# EAGLE design cachev (EAGLE 5.04)
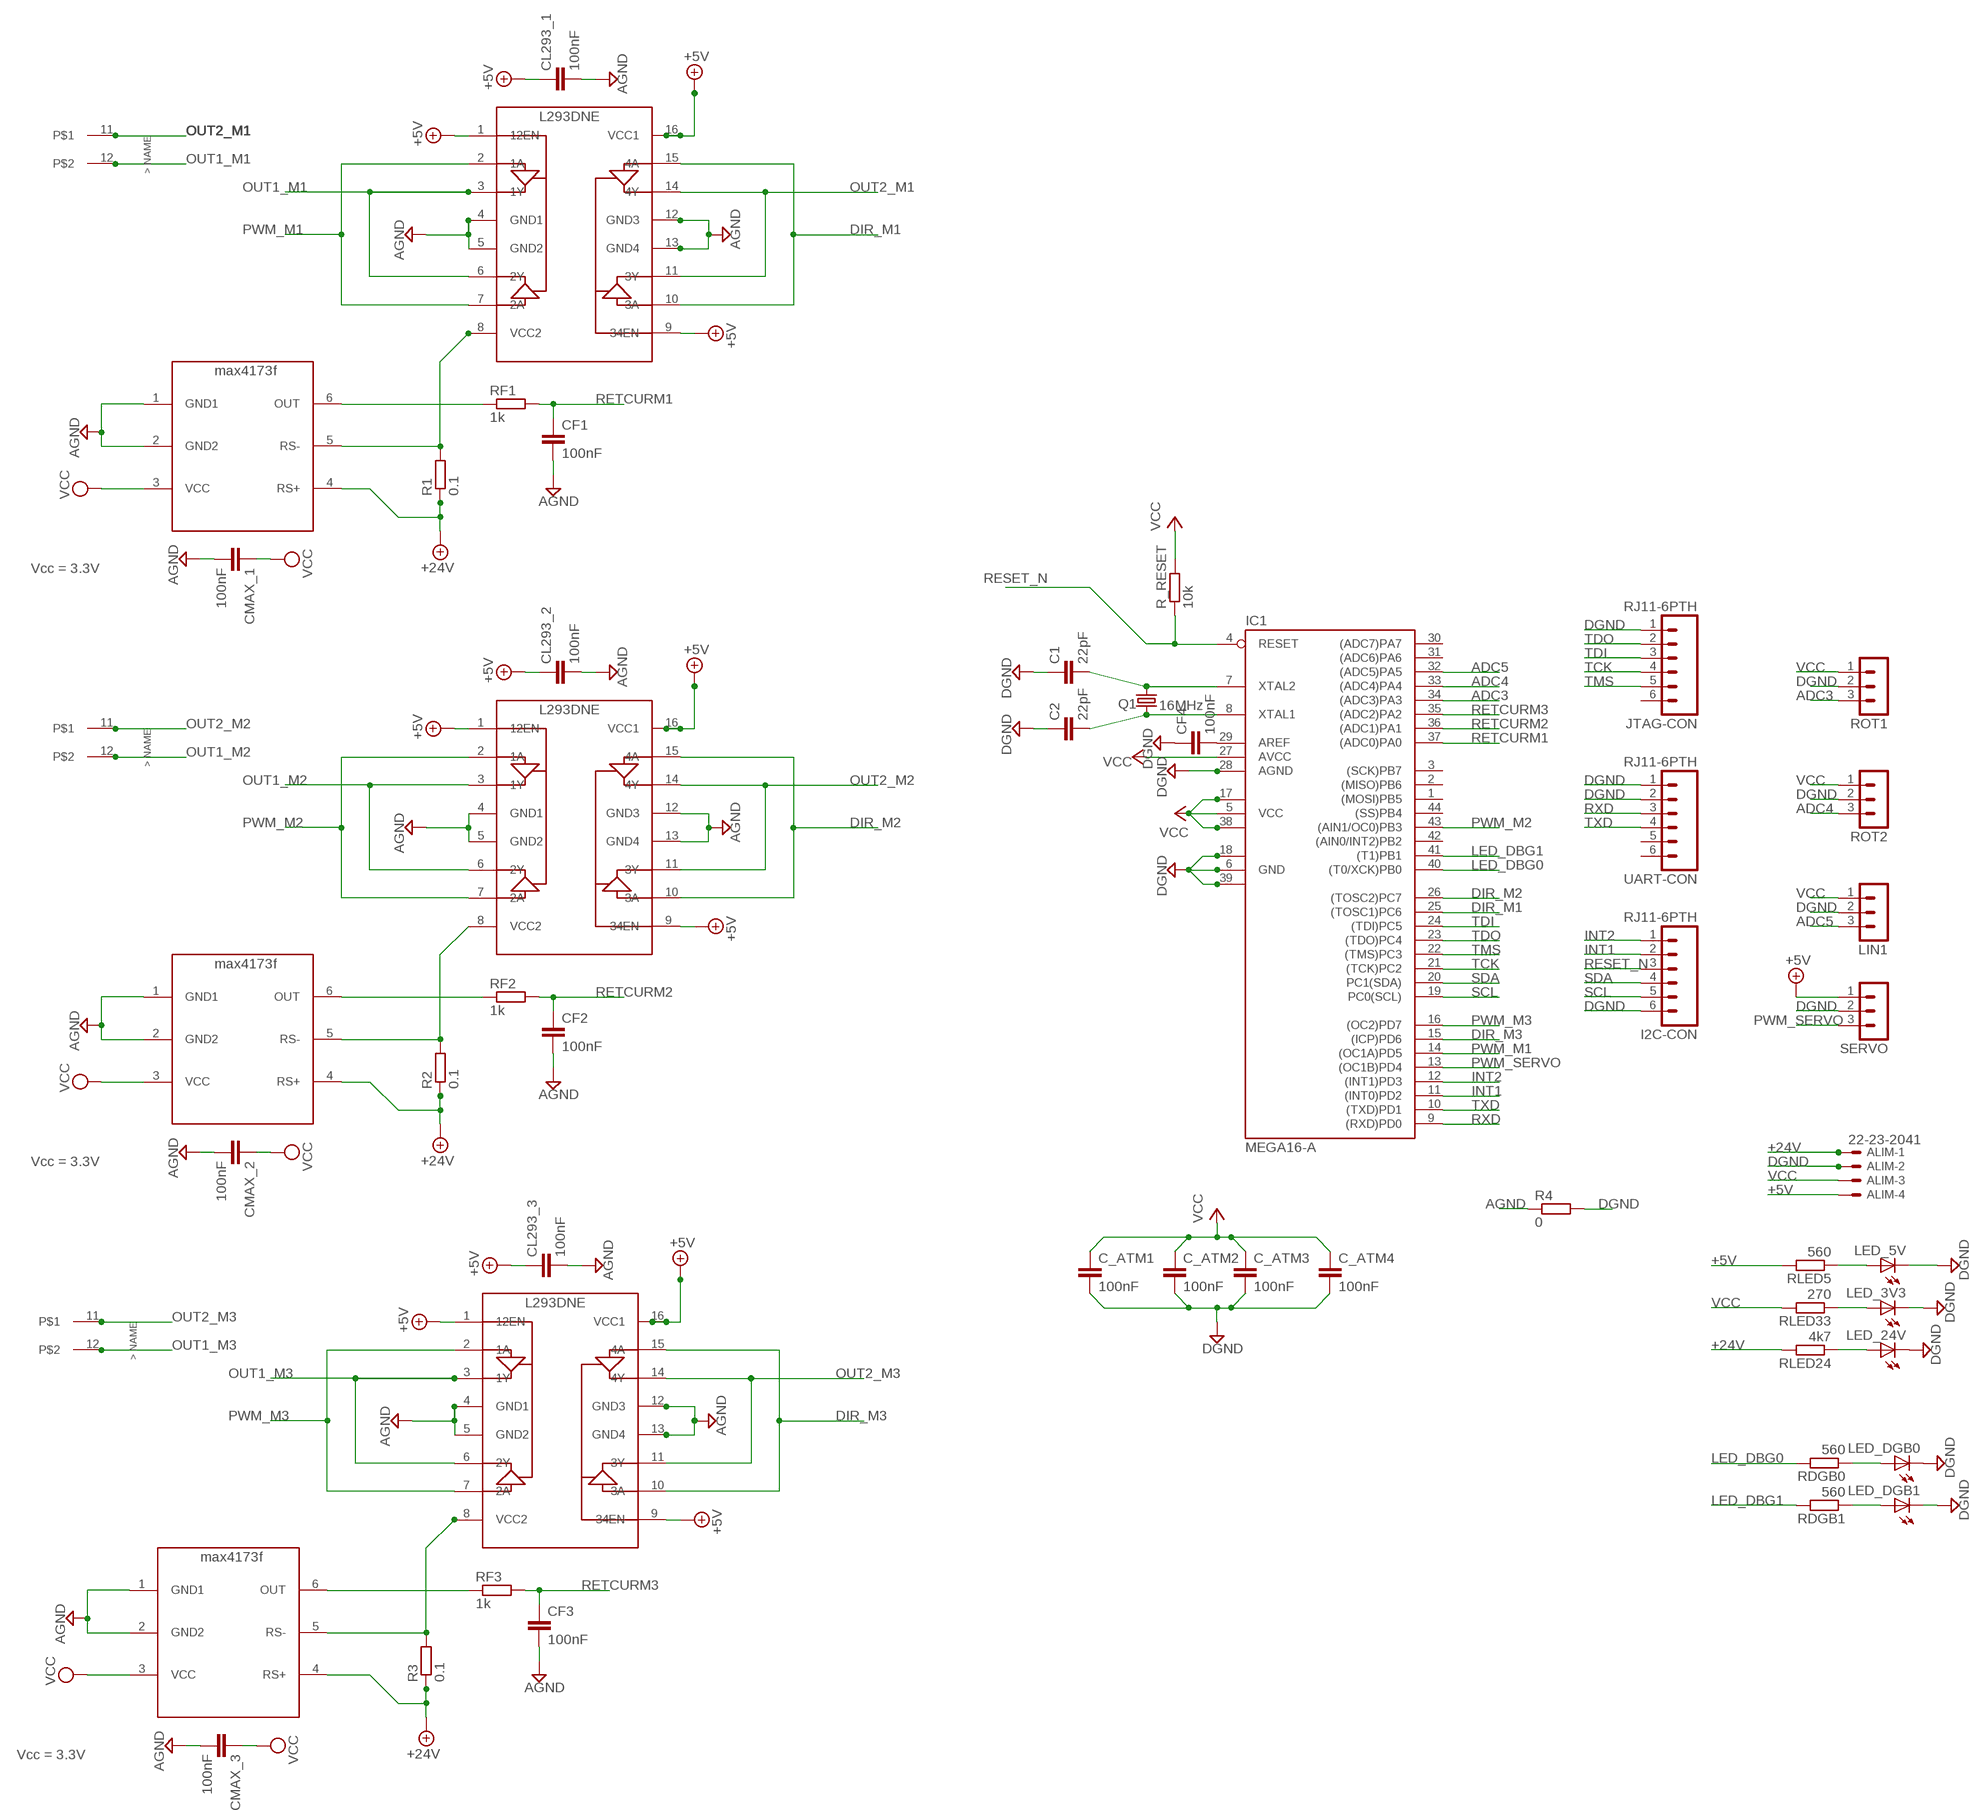
[diagram p0: schematic, sheet 1]

## Parts
ALIM  22-23-2041  [22-23-2041]
C1  22pF  C-EUC0603  [C0603]
C2  22pF  C-EUC0603  [C0603]
C_ATM1  100nF  C-EUC0603  [C0603]
C_ATM2  100nF  C-EUC0603  [C0603]
C_ATM3  100nF  C-EUC0603  [C0603]
C_ATM4  100nF  C-EUC0603  [C0603]
CF1  100nF  C-EUC0603  [C0603]
CF2  100nF  C-EUC0603  [C0603]
CF3  100nF  C-EUC0603  [C0603]
CF4  100nF  C-EUC0603  [C0603]
CL293_1  100nF  C-EUC0603  [C0603]
CL293_2  100nF  C-EUC0603  [C0603]
CL293_3  100nF  C-EUC0603  [C0603]
CMAX_1  100nF  C-EUC0603  [C0603]
CMAX_2  100nF  C-EUC0603  [C0603]
CMAX_3  100nF  C-EUC0603  [C0603]
CONNECTOR_M1  MAT-N-LOK-2  [MAT-N-LOCK-2]
CONNECTOR_M2  MAT-N-LOK-2  [MAT-N-LOCK-2]
CONNECTOR_M3  MAT-N-LOK-2  [MAT-N-LOCK-2]
I2C-CON  RJ11-6PTH  [RJ11-6]
IC1  MEGA16-A  [TQFP44]
JTAG-CON  RJ11-6PTH  [RJ11-6]
LED_3V3  LEDCHIP-LED0805  [CHIP-LED0805]
LED_5V  LEDCHIP-LED0805  [CHIP-LED0805]
LED_24V  LEDCHIP-LED0805  [CHIP-LED0805]
LED_DGB0  LEDCHIP-LED0805  [CHIP-LED0805]
LED_DGB1  LEDCHIP-LED0805  [CHIP-LED0805]
LIN1  MA03-1  [MA03-1]
Q1  16MHz  CRYSTALSM49  [SM49]
R1  0.1  R-EU_R0603  [R0603]
R2  0.1  R-EU_R0603  [R0603]
R3  0.1  R-EU_R0603  [R0603]
R4  0  R-EU_R0603  [R0603]
R_RESET  10k  R-EU_R0603  [R0603]
RDGB0  560  R-EU_R0603  [R0603]
RDGB1  560  R-EU_R0603  [R0603]
RF1  1k  R-EU_R0603  [R0603]
RF2  1k  R-EU_R0603  [R0603]
RF3  1k  R-EU_R0603  [R0603]
RLED5  560  R-EU_R0603  [R0603]
RLED24  4k7  R-EU_R0603  [R0603]
RLED33  270  R-EU_R0603  [R0603]
ROT1  MA03-1  [MA03-1]
ROT2  MA03-1  [MA03-1]
SERVO  MA03-1  [MA03-1]
U$1  L293DNEE4  [DIP16]
U$2  MAX4173F  [SOT23-6]
U$3  L293DNEE4  [DIP16]
U$4  MAX4173F  [SOT23-6]
U$5  L293DNEE4  [DIP16]
U$6  MAX4173F  [SOT23-6]
UART-CON  RJ11-6PTH  [RJ11-6]

## Nets
+5V: ALIM.4 CL293_1.1 CL293_2.1 CL293_3.1 RLED5.2 SERVO.1 U$1.1(12EN) U$1.9(34EN) U$1.16(VCC1) U$3.1(12EN) U$3.9(34EN) U$3.16(VCC1) U$5.1(12EN) U$5.9(34EN) U$5.16(VCC1)
+24V: ALIM.1 R1.1 R2.1 R3.1 RLED24.2 U$2.4(RS+) U$4.4(RS+) U$6.4(RS+)
ADC3: IC1.34((ADC3)PA3) ROT1.3
ADC4: IC1.33((ADC4)PA4) ROT2.3
ADC5: IC1.32((ADC5)PA5) LIN1.3
AGND: CF1.2 CF2.2 CF3.2 CL293_1.2 CL293_2.2 CL293_3.2 CMAX_1.2 CMAX_2.2 CMAX_3.2 R4.1 U$1.4(GND1) U$1.5(GND2) U$1.12(GND3) U$1.13(GND4) U$2.1(GND1) U$2.2(GND2) U$3.4(GND1) U$3.5(GND2) U$3.12(GND3) U$3.13(GND4) U$4.1(GND1) U$4.2(GND2) U$5.4(GND1) U$5.5(GND2) U$5.12(GND3) U$5.13(GND4) U$6.1(GND1) U$6.2(GND2)
DGND: ALIM.2 C1.1 C2.1 C_ATM1.2 C_ATM2.2 C_ATM3.2 C_ATM4.2 CF4.1 I2C-CON.6 IC1.6(GND) IC1.18(GND1) IC1.28(AGND) IC1.39(GND2) JTAG-CON.1 LED_3V3.C LED_5V.C LED_24V.C LED_DGB0.C LED_DGB1.C LIN1.2 R4.2 ROT1.2 ROT2.2 SERVO.2 UART-CON.1 UART-CON.2
DIR_M1: IC1.25((TOSC1)PC6) U$1.10(3A) U$1.15(4A)
DIR_M2: IC1.26((TOSC2)PC7) U$3.10(3A) U$3.15(4A)
DIR_M3: IC1.15((ICP)PD6) U$5.10(3A) U$5.15(4A)
INT1: I2C-CON.2 IC1.11((INT0)PD2)
INT2: I2C-CON.1 IC1.12((INT1)PD3)
LED_DBG0: IC1.40((T0/XCK)PB0) RDGB0.2
LED_DBG1: IC1.41((T1)PB1) RDGB1.2
N$1: CF4.2 IC1.29(AREF)
N$2: LED_5V.A RLED5.1
N$3: C1.2 IC1.7(XTAL2) Q1.1
N$4: C2.2 IC1.8(XTAL1) Q1.2
N$5: LED_3V3.A RLED33.1
N$6: LED_24V.A RLED24.1
N$7: LED_DGB0.A RDGB0.1
N$8: LED_DGB1.A RDGB1.1
OUT1_M1: CONNECTOR_M1.12 U$1.3(1Y) U$1.6(2Y)
OUT1_M2: CONNECTOR_M2.12 U$3.3(1Y) U$3.6(2Y)
OUT1_M3: CONNECTOR_M3.12 U$5.3(1Y) U$5.6(2Y)
OUT2_M1: CONNECTOR_M1.11 U$1.11(3Y) U$1.14(4Y)
OUT2_M2: CONNECTOR_M2.11 U$3.11(3Y) U$3.14(4Y)
OUT2_M3: CONNECTOR_M3.11 U$5.11(3Y) U$5.14(4Y)
PWM_M1: IC1.14((OC1A)PD5) U$1.2(1A) U$1.7(2A)
PWM_M2: IC1.43((AIN1/OC0)PB3) U$3.2(1A) U$3.7(2A)
PWM_M3: IC1.16((OC2)PD7) U$5.2(1A) U$5.7(2A)
PWM_SERVO: IC1.13((OC1B)PD4) SERVO.3
RESET_N: I2C-CON.3 IC1.4(RESET) R_RESET.1
RETCURM1: CF1.1 IC1.37((ADC0)PA0) RF1.2
RETCURM2: CF2.1 IC1.36((ADC1)PA1) RF2.2
RETCURM3: CF3.1 IC1.35((ADC2)PA2) RF3.2
RETCURPINCE1_NF: RF1.1 U$2.6(OUT)
RETCURPINCE1_NF1: RF2.1 U$4.6(OUT)
RETCURPINCE1_NF2: RF3.1 U$6.6(OUT)
RXD: IC1.9((RXD)PD0) UART-CON.3
SCL: I2C-CON.5 IC1.19(PC0(SCL))
SDA: I2C-CON.4 IC1.20(PC1(SDA))
TCK: IC1.21((TCK)PC2) JTAG-CON.4
TDI: IC1.24((TDI)PC5) JTAG-CON.3
TDO: IC1.23((TDO)PC4) JTAG-CON.2
TMS: IC1.22((TMS)PC3) JTAG-CON.5
TXD: IC1.10((TXD)PD1) UART-CON.4
VCC: ALIM.3 C_ATM1.1 C_ATM2.1 C_ATM3.1 C_ATM4.1 CMAX_1.1 CMAX_2.1 CMAX_3.1 IC1.5(VCC) IC1.17(VCC1) IC1.27(AVCC) IC1.38(VCC2) LIN1.1 R_RESET.2 RLED33.2 ROT1.1 ROT2.1 U$2.3(VCC) U$4.3(VCC) U$6.3(VCC)
VCC2_M1: R1.2 U$1.8(VCC2) U$2.5(RS-)
VCC2_M2: R2.2 U$3.8(VCC2) U$4.5(RS-)
VCC2_M3: R3.2 U$5.8(VCC2) U$6.5(RS-)
Unconnected: IC1.1((MOSI)PB5) IC1.2((MISO)PB6) IC1.3((SCK)PB7) IC1.30((ADC7)PA7) IC1.31((ADC6)PA6) IC1.42((AIN0/INT2)PB2) IC1.44((SS)PB4) JTAG-CON.6 UART-CON.5 UART-CON.6

## Notes on the sheet
- Vcc = 3.3V
- Vcc = 3.3V
- Vcc = 3.3V

## Library data of the parts
ALIM = con-molex:22-23-2041: .100" (2.54mm) Center Header - 4 Pin
C1 C2 C_ATM1-C_ATM4 CF1-CF4 CL293_1-CL293_3 CMAX_1-CMAX_3 = rcl:C-EU: CAPACITOR, European symbol
CONNECTOR_M1-CONNECTOR_M3 = cachev:MAT-N-LOK-2
I2C-CON JTAG-CON UART-CON = SparkFun:RJ11-6: RJ11 Jack Simple 6 pin RJ11 jack. Commonly found on CAT3 devices and Microchip programmers. SKU: PRT-00132
IC1 = atmel:MEGA16: MICROCONTROLLER 16 Kbytes FLASH 1 kbytes SRAM 512 bytes EEPROM USART 8-channel 10 bit ADC Source: avr.lbr
LED_3V3 LED_5V LED_24V LED_DGB0 LED_DGB1 = led:LED: LED OSRAM: - CHIPLED LG R971, LG N971, LY N971, LG Q971, LY Q971, LO R971, LY R971 LH N974, LH R974 LS Q976, LO Q976, LY Q976 LO Q996 - Hyper CHIPLED LW Q18S LB Q993, LB Q99A, LB R99A - SideLED LS A670, LO A670, LY A670, LG A670, LP A670 LB A673, LV A673, LT A673, LW A673 LH A674 LY A675 LS A676, LA A676, LO A676, LY A676, LW A676 LS A679, LY A679, LG A679 - Hyper Micro SIDELED® LS Y876, LA Y876, LO Y876, LY Y876 LT Y87S - SmartLED LW L88C, LW L88S LB L89C, LB L89S, LG L890 LS L89K, LO L89K, LY L89K LS L896, LA L896, LO L896, LY L896 - TOPLED LS T670, LO T670, LY T670, LG T670, LP T670 LSG T670, LSP T670, LSY T670, LOP T670, LYG T670 LG T671, LOG T671, LSG T671 LB T673, LV T673, LT T673, LW T673 LH T674 LS T676, LA T676, LO T676, LY T676, LB T676, LH T676, LSB T676, LW T676 LB T67C, LV T67C, LT T67C, LS T67K, LO T67K, LY T67K, LW E67C LS E67B, LA E67B, LO E67B, LY E67B, LB E67C, LV E67C, LT E67C LW T67C LS T679, LY T679, LG T679 LS T770, LO T770, LY T770, LG T770, LP T770 LB T773, LV T773, LT T773, LW T773 LH T774 LS E675, LA E675, LY E675, LS T675 LS T776, LA T776, LO T776, LY T776, LB T776 LHGB T686 LT T68C, LB T68C - Hyper Mini TOPLED® LB M676 - Mini TOPLED Santana® LG M470 LS M47K, LO M47K, LY M47K Source: http://www.osram.convergy.de - LUMILED® LXK2-PW12-R00, LXK2-PW12-S00, LXK2-PW14-U00, LXK2-PW14-V00 LXK2-PM12-R00, LXK2-PM12-S00, LXK2-PM14-U00 LXK2-PE12-Q00, LXK2-PE12-R00, LXK2-PE12-S00, LXK2-PE14-T00, LXK2-PE14-U00 LXK2-PB12-K00, LXK2-PB12-L00, LXK2-PB12-M00, LXK2-PB14-N00, LXK2-PB14-P00, LXK2-PB14-Q00 LXK2-PR12-L00, LXK2-PR12-M00, LXK2-PR14-Q00, LXK2-PR14-R00 LXK2-PD12-Q00, LXK2-PD12-R00, LXK2-PD12-S00 LXK2-PH12-R00, LXK2-PH12-S00 LXK2-PL12-P00, LXK2-PL12-Q00, LXK2-PL12-R00 Source: www.luxeon.com
LIN1 ROT1 ROT2 SERVO = con-lstb:MA03-1: PIN HEADER
Q1 = crystal:CRYSTAL: CRYSTAL
R1-R4 R_RESET RDGB0 RDGB1 RF1-RF3 RLED5 RLED24 RLED33 = rcl:R-EU_: RESISTOR, European symbol
U$1 U$3 U$5 = cachev:L293DNEE4
U$2 U$4 U$6 = cachev:MAX4173F

## Board
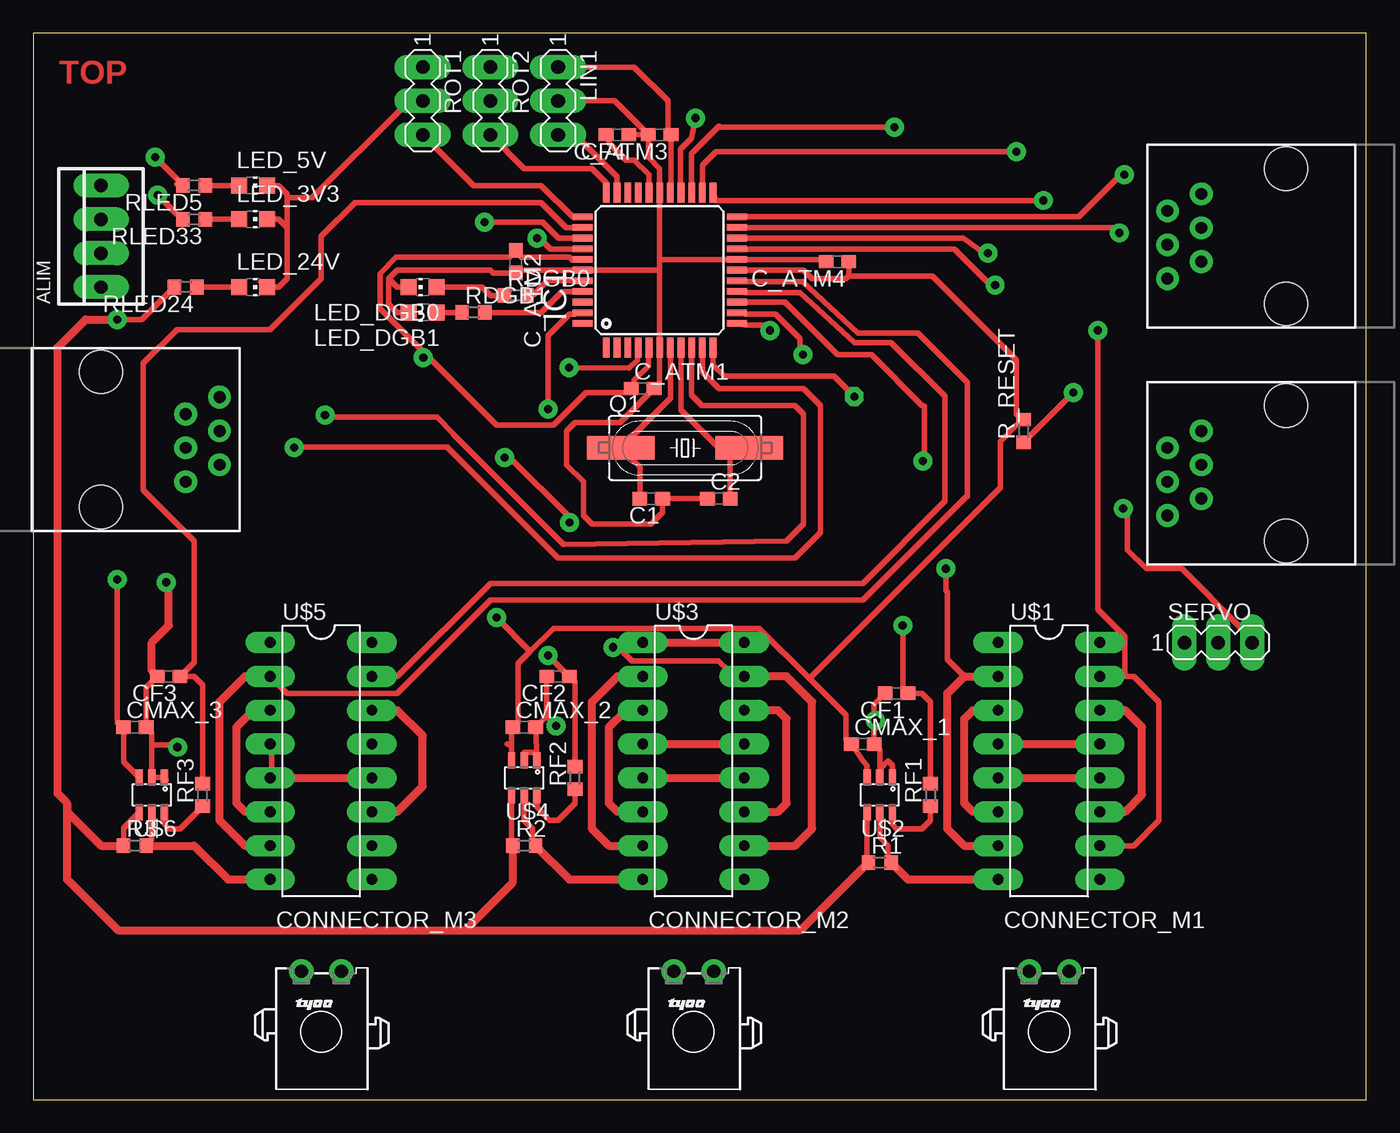
[diagram p1: board, top side]
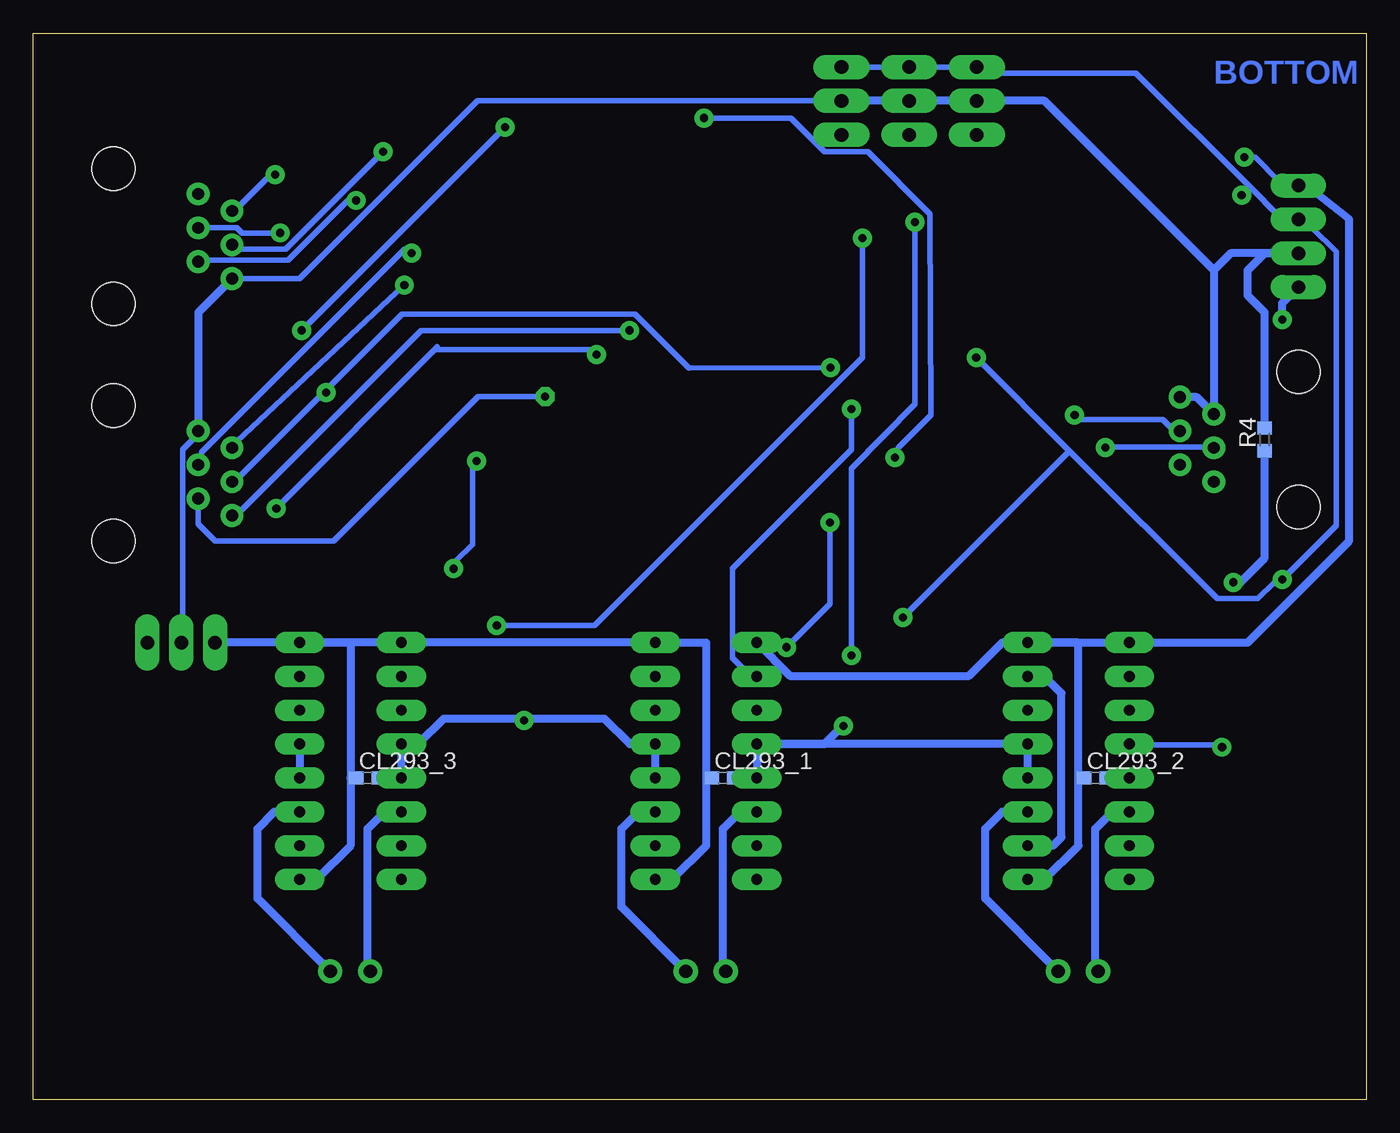
[diagram p2: board, bottom side, seen from below]

Size 100 x 80 mm. Coordinates in mm from the lower left corner, seen from the top.
Outline: 0,0 100,0 100,80 0,80 0,0
Copper layers (1*16): Top 0.035mm / dielectric 1.5mm / Bottom 0.035mm
Design rules "default *": minimum track width 16mil, minimum drill 24mil, track to track 8mil, track to pad 8mil, pad to pad 8mil, via to via 8mil, smd to smd 8mil, copper to edge 40mil, drill to drill 8mil, minimum pad ring 16mil, minimum via ring 16mil, stop-mask expansion 4mil, vias tented up to drill 0mil, thermal gap 10mil
tKeepout: area -3.1,42.5 to 15.7,56.6
tRestrict: area 42.1,57.3 to 51.9,67.1; area 1.6,59.4 to 8.5,70.2; area 83.5,57.8 to 102.2,71.8; area 83.5,40.1 to 102.2,53.9; area -3.1,42.5 to 15.7,56.6
bRestrict: area 88.7,2.5 to 97.4,19.5
vRestrict: area 40,55.6 to 53.9,68.8; area 42.5,51.7 to 55.6,55.7; area 1.7,59.5 to 8.5,70.1; area -3.2,42.4 to 15.8,56.7

### Footprints (pad centres in the part's own frame; a part is rotated, then mirrored left to right if it is on the bottom)
22-23-2041 = drill 1 long: 1 -3.81,0; 2 -1.27,0; 3 1.27,0; 4 3.81,0
C0603 = smd 1.1 x 1: 1 -0.85,0; 2 0.85,0
MAT-N-LOCK-2 = drill 1 pad 1.676 round: 11 1.523,4.543; 12 -1.477,4.543
RJ11-6 = drill 0.889 round: 1 1.905,8.89; 2 3.175,6.35; 3 4.445,8.89; 4 5.715,6.35; 5 6.985,8.89; 6 8.255,6.35 | hole 3.251: 0,0; 10.16,0
TQFP44 = smd 1.5 x 0.5: 1 -5.8,4; 2 -5.8,3.2; 3 -5.8,2.4; 4 -5.8,1.6; 5 -5.8,0.8; 6 -5.8,0; 7 -5.8,-0.8; 8 -5.8,-1.6; 9 -5.8,-2.4; 10 -5.8,-3.2; 11 -5.8,-4; 23 5.8,-4; 24 5.8,-3.2; 25 5.8,-2.4; 26 5.8,-1.6; 27 5.8,-0.8; 28 5.8,0; 29 5.8,0.8; 30 5.8,1.6; 31 5.8,2.4; 32 5.8,3.2; 33 5.8,4 | smd 0.5 x 1.5: 12 -4,-5.8; 13 -3.2,-5.8; 14 -2.4,-5.8; 15 -1.6,-5.8; 16 -0.8,-5.8; 17 0,-5.8; 18 0.8,-5.8; 19 1.6,-5.8; 20 2.4,-5.8; 21 3.2,-5.8; 22 4,-5.8; 34 4,5.8; 35 3.2,5.8; 36 2.4,5.8; 37 1.6,5.8; 38 0.8,5.8; 39 0,5.8; 40 -0.8,5.8; 41 -1.6,5.8; 42 -2.4,5.8; 43 -3.2,5.8; 44 -4,5.8
CHIP-LED0805 = smd 1.2 x 1.2: A 0,-1.05; C 0,1.05
MA03-1 = drill 1.016 long: 1 -2.54,0; 2 0,0; 3 2.54,0
SM49 = smd 5.08 x 1.778: 1 -4.826,0; 2 4.826,0
R0603 = smd 1 x 1.1: 1 -0.85,0; 2 0.85,0
DIP16 = drill 0.813 long: 1 -3.81,7.62; 2 -3.81,5.08; 3 -3.81,2.54; 4 -3.81,0; 5 -3.81,-2.54; 6 -3.81,-5.08; 7 -3.81,-7.62; 8 -3.81,-10.16; 9 3.81,-10.16; 10 3.81,-7.62; 11 3.81,-5.08; 12 3.81,-2.54; 13 3.81,0; 14 3.81,2.54; 15 3.81,5.08; 16 3.81,7.62
SOT23-6 = smd 0.55 x 1.2: 1 -0.95,-1.3; 2 0,-1.3; 3 0.95,-1.3; 4 0.95,1.3; 5 0,1.3; 6 -0.95,1.3

### Placement (x,y rotation side)
ALIM  5.08,64.77 90 top
C1  46.35,45.09 180 top
C2  51.44,45.09 0 top
C_ATM1  45.72,53.34 0 top
C_ATM2  36.2,62.87 270 top
C_ATM3  46.99,72.39 180 top
C_ATM4  60.33,62.87 180 top
CF1  64.77,30.48 180 top
CF2  39.37,31.75 180 top
CF3  10.16,31.75 180 top
CF4  43.81,72.39 180 top
CL293_1  48.26,24.13 0 bottom
CL293_2  20.32,24.13 0 bottom
CL293_3  74.93,24.13 0 bottom
CMAX_1  62.23,26.67 0 top
CMAX_2  36.83,27.94 0 top
CMAX_3  7.62,27.94 0 top
CONNECTOR_M1  76.2,5.08 0 top
CONNECTOR_M2  49.53,5.08 0 top
CONNECTOR_M3  21.59,5.08 0 top
I2C-CON  93.98,41.91 90 top
IC1  46.99,62.23 90 top
JTAG-CON  93.98,59.69 90 top
LED_3V3  16.51,66.04 270 top
LED_5V  16.51,68.58 270 top
LED_24V  16.51,60.96 270 top
LED_DGB0  29.21,60.96 90 top
LED_DGB1  29.21,59.05 90 top
LIN1  39.37,74.93 270 top
Q1  48.9,48.9 0 top
R1  63.5,17.78 0 top
R2  36.83,19.05 0 top
R3  7.62,19.05 0 top
R4  7.62,49.53 90 bottom
R_RESET  74.3,50.16 90 top
RDGB0  36.2,60.33 0 top
RDGB1  33.02,59.05 0 top
RF1  67.31,22.86 90 top
RF2  40.64,24.13 90 top
RF3  12.7,22.86 90 top
RLED5  12.06,68.58 180 top
RLED24  11.43,60.96 180 top
RLED33  12.06,66.04 180 top
ROT1  29.21,74.93 270 top
ROT2  34.29,74.93 270 top
SERVO  88.9,34.29 0 top
U$1  76.2,26.67 0 top
U$2  63.5,22.86 180 top
U$3  49.53,26.67 0 top
U$4  36.83,24.13 180 top
U$5  21.59,26.67 0 top
U$6  8.89,22.86 180 top
UART-CON  5.08,54.61 270 top

### Tracks (layer width: path | path; a pad name or v marks a point on that pad's centre or on a via)
+5V  (via drill 0.61)
  Top 0.406: 10.77,68.68 RLED5.2 10.77,69.09 v9.14,70.71
  Top 0.61: U$3.1 U$3.16
  Bottom 0.406: v9.14,70.71 8.33,70.71 6.5,68.89 ALIM.4
  Bottom 0.61: U$5.16 U$5.1 8.89,34.29 1.27,41.91 1.27,66.04 4.45,68.58 ALIM.4 | U$1.16 U$1.1 U$3.16 49.53,34.29 49.53,24.13 | U$1.16 SERVO.1 | U$5.16 21.59,34.29 21.59,24.13 | 21.59,24.13 21.59,19.05 24.13,16.51 U$5.9 | 49.53,24.13 49.53,19.05 52.07,16.51 U$3.9 | U$1.16 76.2,34.29 76.2,24.13 | 76.2,24.13 76.2,19.05 78.74,16.51 U$1.9 | 76.2,24.13 CL293_3.1 | 49.53,24.13 CL293_1.1 | 21.59,24.13 CL293_2.1 | U$5.16 27.3,34.29 29.84,31.75 43.18,31.75 U$3.1
+24V  (via drill 0.61)
  Top 0.406: U$6.4 6.77,20.39 R3.1 | R2.1 35.88,19.15 U$4.4 | U$2.4 62.55,17.78 R1.1 | v6.3,58.52 8.13,58.52 10.16,60.55 RLED24.2 | 2.54,22.23 2.44,22.35
  Top 0.61: R3.1 5.08,19.05 2.54,21.59 2.54,22.23 2.54,16.51 6.35,12.7 31.75,12.7 | R2.1 35.98,16.3 32.38,12.7 31.75,12.7 | R1.1 57.57,12.7 31.75,12.7 | v6.3,58.52 3.92,58.52 1.83,56.43 1.83,22.96 2.44,22.35
  Bottom 0.61: v6.3,58.52 6.3,59.74 ALIM.1
ADC3
  Top 0.406: IC1.34 40.45,66.23 38.1,68.58 33.02,68.58 ROT1.3
ADC4
  Top 0.406: IC1.33 42.99,68.77 41.91,69.85 36.83,69.85 ROT2.3
ADC5
  Top 0.406: LIN1.3 40.64,72.39 43.79,69.24 IC1.32
AGND  (via drill 0.61)
  Top 0.406: CF3.2 8.47,30.91 CMAX_3.2 8.89,27.52 8.89,26.62 | 8.89,26.62 U$6.2 U$6.1 9.96,23.98 | 38.5,28.76 CMAX_2.2 U$4.1 37.78,26.04 36.83,26.04 U$4.2 | 38.5,28.76 38.52,28.78 CF2.2 | 63.08,28.45 CMAX_1.2 63.5,26.25 U$2.2 63.5,24.77 64.14,25.4 64.45,25.09 U$2.1 | 63.08,28.45 63.08,29.64 CF1.2 | U$5.5 17.88,24.59 17.88,26.21 U$5.4 | v10.82,26.44 10.16,26.62 8.89,26.62 | v39.22,28.04 38.5,28.76 | v63.2,28.45 63.08,28.45 | 10.16,38.73 v9.96,38.81
  Top 0.61: U$3.5 U$3.12 | U$3.4 U$3.13 | U$5.5 U$5.12 | U$1.5 U$1.12 | U$1.4 U$1.13 | 10.16,38.73 10.16,35.56 8.89,34.29 8.89,32.17 CF3.2
  Bottom 0.406: CL293_2.2 19.1,24.18 18.9,24.18 U$5.5 16.66,23.98 | v10.82,26.44 11.38,26.62 16.66,26.62 U$5.4 | 39.37,27.94 v39.22,28.04 | 63.2,28.57 v63.2,28.45 | v9.96,38.81 9.75,38.81 9.53,38.73
  Bottom 0.61: CL293_3.2 U$1.5 U$1.4 71.12,26.67 69.22,28.57 63.2,28.57 57.15,28.57 55.24,26.67 U$3.13 U$3.12 | CL293_1.2 U$3.5 U$3.4 | U$3.4 U$5.13 U$5.12 | U$1.13 U$1.12 | U$3.4 40.64,26.67 39.37,27.94 | R4.1 7.62,40.64 9.53,38.73
DGND
  Top 0.406: LIN1.2 43.6,74.93 C_ATM3.2 | C_ATM3.2 46.14,70.7 46.99,69.85 IC1.28 46.99,62.87 | 46.99,62.87 46.99,62.23 | 46.99,62.23 IC1.6 46.99,53.76 C_ATM1.2 44.03,50.8 40.64,50.8 40.01,50.16 40.01,47.62 41.27,46.35 41.27,43.81 41.91,43.18 46.35,43.18 47.2,44.03 C1.1 C2.1 | 46.99,62.23 IC1.39 36.2,62.23 C_ATM2.2 34.51,62.02 34.29,62.23 27.3,62.23 26.67,61.59 | 46.99,62.87 47.16,63.03 IC1.18 59.31,63.03 C_ATM4.2 | C_ATM3.2 46.35,72.39 | C_ATM3.2 CF4.1 | 19.05,65.41 19.05,61.59 18.41,60.96 LED_24V.C 17.07,61.37 | 19.05,65.41 18.41,66.04 LED_3V3.C | LED_5V.C 18.41,68.58 19.05,67.94 19.05,67.67 | 19.05,67.67 19.05,65.41 | 26.67,61.59 27.3,60.96 LED_DGB0.C | LED_DGB1.C 27.3,59.05 26.67,59.69 26.67,61.59 | 19.05,67.67 20.93,67.67 27.84,74.57 ROT1.2
  Bottom 0.406: JTAG-CON.1 80.01,61.59 66.67,74.93 LIN1.2 | SERVO.2 88.8,35.76 88.8,48.77 87.99,49.58 I2C-CON.6
  Bottom 0.61: LIN1.2 ROT2.2 ROT1.2 24.13,74.93 11.43,62.23 | 11.43,62.23 10.16,63.5 ALIM.2 7.62,63.5 8.89,62.23 8.89,60.33 7.62,59.05 R4.2 7.62,50.16 | 11.43,62.23 UART-CON.2 12.7,52.7 UART-CON.1 | JTAG-CON.1 87.63,59.05 I2C-CON.6
  pour Top: 50.16,66.04 43.81,66.04 43.18,65.41 43.18,59.05 43.81,58.42 50.16,58.42 50.8,59.05 50.8,65.41
DIR_M1  (via drill 0.61)
  Top 0.406: 81.89,31.75 82.55,31.75 84.45,29.84 84.45,20.95 82.55,19.05 U$1.10 | 81.89,31.75 U$1.15 | IC1.25 49.39,70.98 51.44,73.03 51.61,72.95 v64.62,72.95 | v79.86,57.71 79.86,36.78 81.89,34.75 81.89,31.75
  Bottom 0.406: v79.86,57.71 v64.62,72.95
DIR_M2  (via drill 0.61)
  Top 0.406: v49.68,73.65 49.38,72.14 48.56,71.32 48.56,68.68 IC1.26 | v43.48,33.93 43.89,33.93 44.91,32.92 51.41,32.92 52.22,32.11 U$3.15 | v35.36,48.16 35.97,47.95 40.03,43.89 v40.23,43.28
  Top 0.61: U$3.10 57.15,19.05 58.42,20.32 58.42,29.84 56.52,31.75 U$3.15
  Bottom 0.406: v49.68,73.65 43.17,73.65 40.64,71.12 37.39,71.12 32.72,66.45 32.66,51.35 35.09,48.91 35.15,48.77 v35.36,48.16 | v40.23,43.28 40.23,37.19 v43.48,33.93
DIR_M3
  Top 0.406: U$5.15 27.3,31.75 34.29,38.73 62.23,38.73 68.41,44.91 68.41,52.77 64.36,56.79 61.6,56.79 57.51,60.55 53.44,60.55 IC1.15
  Bottom 0.61: U$5.10 23.5,19.05 22.86,19.68 22.86,30.48 24.13,31.75 U$5.15
INT1  (via drill 0.6)
  Top 0.406: IC1.11 50.99,55.12 51.84,54.27 60.06,54.27 v61.59,52.74
  Bottom 0.406: I2C-CON.2 87.63,43.18 86.36,41.91 77.47,41.91 66.64,52.74 v61.59,52.74
INT2  (via drill 0.61)
  Top 0.406: v55.27,57.71 54.86,58.12 53.44,58.12 IC1.12
  Bottom 0.406: v55.27,57.71 70.92,57.71 84.53,44.09 I2C-CON.1
LED_DBG0
  Top 0.406: IC1.40 38.57,61.43 37.47,60.33 RDGB0.2
LED_DBG1
  Top 0.406: IC1.41 39.67,60.63 38.1,59.05 RDGB1.2 33.66,59.05
N$1
  Top 0.406: IC1.29 46.19,69.38 45.09,70.48 44.45,70.48 43.18,71.75 43.18,72.39 CF4.2
N$2
  Top 0.406: RLED5.1 LED_5V.A
N$3
  Top 0.406: IC1.7 47.79,52.62 Q1.1 45.51,47.46 C1.2
N$4
  Top 0.406: IC1.8 48.59,51.74 51.44,48.9 52.7,48.9 | 52.7,48.9 Q1.2 | C2.2 52.28,48.48 52.7,48.9
N$5
  Top 0.406: 12.7,66.04 RLED33.1 LED_3V3.A
N$6
  Top 0.406: RLED24.1 LED_24V.A
N$7
  Top 0.406: LED_DGB0.A 33.66,60.96 34.29,60.33 RDGB0.1
N$8
  Top 0.406: LED_DGB1.A RDGB1.1
OUT1_M1
  Top 0.61: U$1.3 70.48,29.21 69.85,28.57 69.85,22.23 70.48,21.59 U$1.6
  Bottom 0.61: U$1.6 73.66,21.59 74.93,20.32 74.93,9.83 CONNECTOR_M1.12
OUT1_M2
  Top 0.61: U$3.3 44.45,29.21 43.18,27.94 43.18,22.23 43.81,21.59 U$3.6
  Bottom 0.61: U$3.6 46.99,21.59 48.26,20.32 48.26,9.83 CONNECTOR_M2.12
OUT1_M3
  Top 0.61: U$5.3 16.51,29.21 15.24,27.94 15.24,22.23 15.88,21.59 U$5.6
  Bottom 0.61: U$5.6 19.05,21.59 20.32,20.32 20.32,9.83 CONNECTOR_M3.12
OUT2_M1
  Top 0.61: U$1.14 81.92,29.21 83.19,27.94 83.19,22.86 81.92,21.59 U$1.11
  Bottom 0.61: U$1.11 81.92,21.59 83.19,20.32 83.19,15.09 CONNECTOR_M1.11
OUT2_M2
  Top 0.61: U$3.14 55.88,29.21 56.52,28.57 56.52,22.23 55.88,21.59 U$3.11
  Bottom 0.61: U$3.11 54.61,21.59 55.88,20.32 55.88,14.45 CONNECTOR_M2.11
OUT2_M3
  Top 0.61: U$5.14 27.3,29.21 29.21,27.3 29.21,23.5 27.3,21.59 U$5.11
  Bottom 0.61: U$5.11 27.3,21.59 28.57,20.32 28.57,15.09 CONNECTOR_M3.11
PWM_M1  (via drill 0.61)
  Top 0.406: IC1.14 56.38,59.83 60.33,55.88 62.87,55.88 66.67,52.07 66.85,52.02 66.85,48.56 v66.74,47.9 | 69.85,31.75 68.58,33.02 68.58,38.1 68.48,38.2 v68.48,39.83
  Top 0.61: U$1.2 69.85,31.75 68.58,30.48 68.58,20.32 69.85,19.05 U$1.7
  Bottom 0.406: v66.74,47.9 67.06,47.35 67.06,41.66 68.28,40.44 v68.48,39.83
PWM_M2  (via drill 0.61)
  Top 0.406: v38.61,51.82 38.61,57.3 40.23,58.93 40.64,58.93 IC1.43
  Top 0.61: U$3.2 43.81,31.75 41.91,29.84 41.91,20.32 43.18,19.05 U$3.7
  Bottom 0.406: v38.61,51.82 38.61,48.77 47.55,39.83 47.55,33.12 46.74,32.31 U$3.2
PWM_M3
  Top 0.406: U$5.2 19.05,30.48 27.3,30.48 34.29,37.47 62.25,37.47 70.1,45.31 | 52.22,61.37 IC1.16 53.44,61.37 57.71,61.37 61.89,57.52 66.36,57.52 70.1,53.78 70.1,45.31 | 70.1,45.31 70.1,45.24
  Top 0.61: U$5.7 15.88,19.05 13.97,20.95 13.97,29.84 15.88,31.75 U$5.2
PWM_SERVO  (via drill 0.61)
  Top 0.406: IC1.13 53.44,58.93 55.68,58.93 57.51,57.1 57.51,56.49 v57.76,55.89 | SERVO.3 90.83,35.36 90.63,35.36 86.16,39.83 83.52,39.83 82.09,41.25 82.09,43.69 v81.77,44.33
  Bottom 0.406: 69.8,56.39 v81.77,44.33 | 69.8,56.39 69.7,56.49 | v57.76,55.89 58.32,56.29 69.7,56.29 69.8,56.39
RESET_N  (via drill 0.61)
  Top 0.406: v40.19,54.92 44.7,54.86 45.31,55.47 45.31,55.88 IC1.4 | v78.03,53.03 74.78,49.78 R_RESET.1
  Bottom 0.406: v40.19,54.92 50.8,54.86 54.86,58.93 72.34,58.93 78.13,53.14 | 78.13,53.14 84.53,46.74 I2C-CON.3 | 78.13,53.14 v78.03,53.03
RETCURM1  (via drill 0.61)
  Top 0.406: RF1.2 67.31,29.84 66.67,30.48 CF1.1 65.23,30.89 v65.23,35.56 | v37.8,64.62 38,64.62 38.81,63.8 40.64,63.8 IC1.37
  Bottom 0.406: v37.8,64.62 37.8,55.68 57.91,35.56 v65.23,35.56
RETCURM2  (via drill 0.61)
  Top 0.406: RF2.2 40.64,31.33 CF2.1 39.83,32.11 v38.61,33.33 | v33.85,65.84 38.2,65.84 39.42,64.62 40.64,64.62 IC1.36
  Bottom 0.406: v33.85,65.84 33.85,52.17 38.61,47.35 v38.61,33.33
RETCURM3
  Top 0.406: RF3.2 12.7,31.11 12.06,31.75 CF3.1 12.06,32.8 12.06,41.91 8.26,45.72 8.26,55.24 10.79,57.78 17.78,57.78 21.59,61.59 21.59,64.77 24.13,67.31 38.1,67.31 39.98,65.43 IC1.35
RETCURPINCE1_NF
  Top 0.406: U$2.6 64.45,20.64 64.77,20.32 66.67,20.32 67.31,20.95 RF1.1
RETCURPINCE1_NF1
  Top 0.406: U$4.6 37.78,21.91 38.73,20.95 39.37,20.95 40.64,22.23 RF2.1
RETCURPINCE1_NF2
  Top 0.406: U$6.6 9.84,20.64 10.16,20.32 11.01,20.32 RF3.1
RXD  (via drill 0.61)
  Top 0.406: IC1.9 49.39,52.84 50.16,52.07 57.15,52.07 57.78,51.44 57.78,43.18 56.52,41.91 39.8,41.64 31.54,49.9 31.5,49.99 30.28,51.21 22.55,51.21 v21.88,51.36
  Bottom 0.406: v21.88,51.36 21.34,51 15.24,51 14.63,50.39 UART-CON.3
SCL  (via drill 0.61)
  Top 0.406: IC1.19 53.44,63.8 69.09,63.8 71.53,61.37 v72.16,61.11
  Bottom 0.406: v72.16,61.11 84.73,49.38 I2C-CON.5
SDA  (via drill 0.61)
  Top 0.406: v71.62,63.51 70.92,63.8 69.77,64.61 69.29,64.62 53.44,64.62 IC1.20
  Bottom 0.406: I2C-CON.4 87.38,48.16 87.38,48.56 72.14,63.8 v71.62,63.51
TCK  (via drill 0.61)
  Top 0.406: IC1.21 53.44,65.43 81.08,65.43 v81.48,65.02
  Bottom 0.406: v81.48,65.02 84.33,65.02 84.73,65.43 86.97,65.43 JTAG-CON.4
TDI  (via drill 0.61)
  Top 0.406: v73.76,71.12 51.21,71.12 50.19,70.1 50.19,68.68 IC1.24
  Bottom 0.406: v73.76,71.12 81.08,63.8 84.53,63.8 JTAG-CON.3
TDO  (via drill 0.61)
  Top 0.406: v75.79,67.46 51.21,67.46 IC1.23
  Bottom 0.406: v75.79,67.46 76.4,67.46 80.87,62.99 86.97,62.99 JTAG-CON.2
TMS  (via drill 0.61)
  Top 0.406: IC1.22 53.44,66.24 78.44,66.24 81.28,69.09 v81.86,69.39
  Bottom 0.406: v81.86,69.39 82.5,69.09 84.53,67.06 JTAG-CON.5
TXD  (via drill 0.61)
  Top 0.406: IC1.10 50.19,54.59 51.44,53.34 57.78,53.34 59.05,52.07 59.05,42.55 57.15,40.64 39.37,40.64 31.11,48.9 31.09,48.97 20.12,48.97 v19.58,48.91
  Bottom 0.406: v19.58,48.91 18.9,48.97 11.99,48.97 UART-CON.4
VCC  (via drill 0.61)
  Top 0.254: IC1.27 47.75,68.07 47.84,68.08
  Top 0.406: 47.84,68.08 C_ATM3.1 47.62,72.61 47.62,74.93 45.09,77.47 LIN1.1 | IC1.5 46.14,56.38 46.14,55.03 45.09,53.98 45.09,53.55 C_ATM1.1 44.5,53.03 41.45,53.03 39.01,50.6 34.75,50.6 29.57,55.78 | U$6.3 6.77,25.33 CMAX_3.1 6.3,28.25 v6.3,39.01 | U$2.3 62.55,25.08 62.23,25.4 CMAX_1.1 60.96,27.03 60.96,28.85 58.22,31.6 | 35.56,26.67 arc-90 35.88,26.35 35.88,26.04 | 35.88,26.04 U$4.3 | 35.88,26.04 35.88,27.84 arc-90 CMAX_2.1 36.37,28.25 36.37,32.72 37.29,33.63 | IC1.17 57.78,62.23 58.42,61.59 60.96,61.59 61.17,61.81 | 61.17,61.81 C_ATM4.1 | 61.17,61.81 61.37,61.77 67.46,61.77 73.76,55.47 73.76,51.41 R_RESET.2 73.76,50.6 72.54,49.38 72.54,45.92 58.22,31.6 | 37.29,33.63 39.01,35.36 54.46,35.36 58.22,31.6 | IC1.38 40.64,62.99 40.44,62.99 40.23,63.2 36.58,63.2 C_ATM2.1 35.76,63.2 27.23,63.2 26.01,61.98 26.01,59.33 29.57,55.78 | v29.26,55.68 29.46,55.68 29.57,55.78 | v34.75,36.17 37.29,33.63 | v9.35,67.87 10.77,66.45 RLED33.2
  Bottom 0.406: 8.74,68.48 6.5,66.24 ALIM.3 4.06,65.43 2.23,63.6 2.23,43.08 v6.3,39.01 6.91,38.81 8.13,37.59 11.18,37.59 22.25,48.67 | 8.74,68.48 17.27,77.01 27.84,77.01 ROT1.1 ROT2.1 LIN1.1 | 22.25,48.67 v29.26,55.68 | 22.25,48.67 v34.75,36.17 | 8.74,68.48 v9.35,67.87
VCC2_M1
  Top 0.406: U$2.5 63.5,19.68 64.14,19.05 64.14,18 R1.2
  Top 0.61: R1.2 65.62,16.51 U$1.8
VCC2_M2
  Top 0.406: U$4.5 36.83,20.95 37.47,20.32 37.47,19.27 R2.2
  Top 0.61: R2.2 40.22,16.51 U$3.8
VCC2_M3
  Top 0.406: R3.2 8.89,19.47 U$6.5
  Top 0.61: R3.2 12.06,19.05 14.61,16.51 U$5.8

### Text on the board
Top: TOP
Bottom: BOTTOM